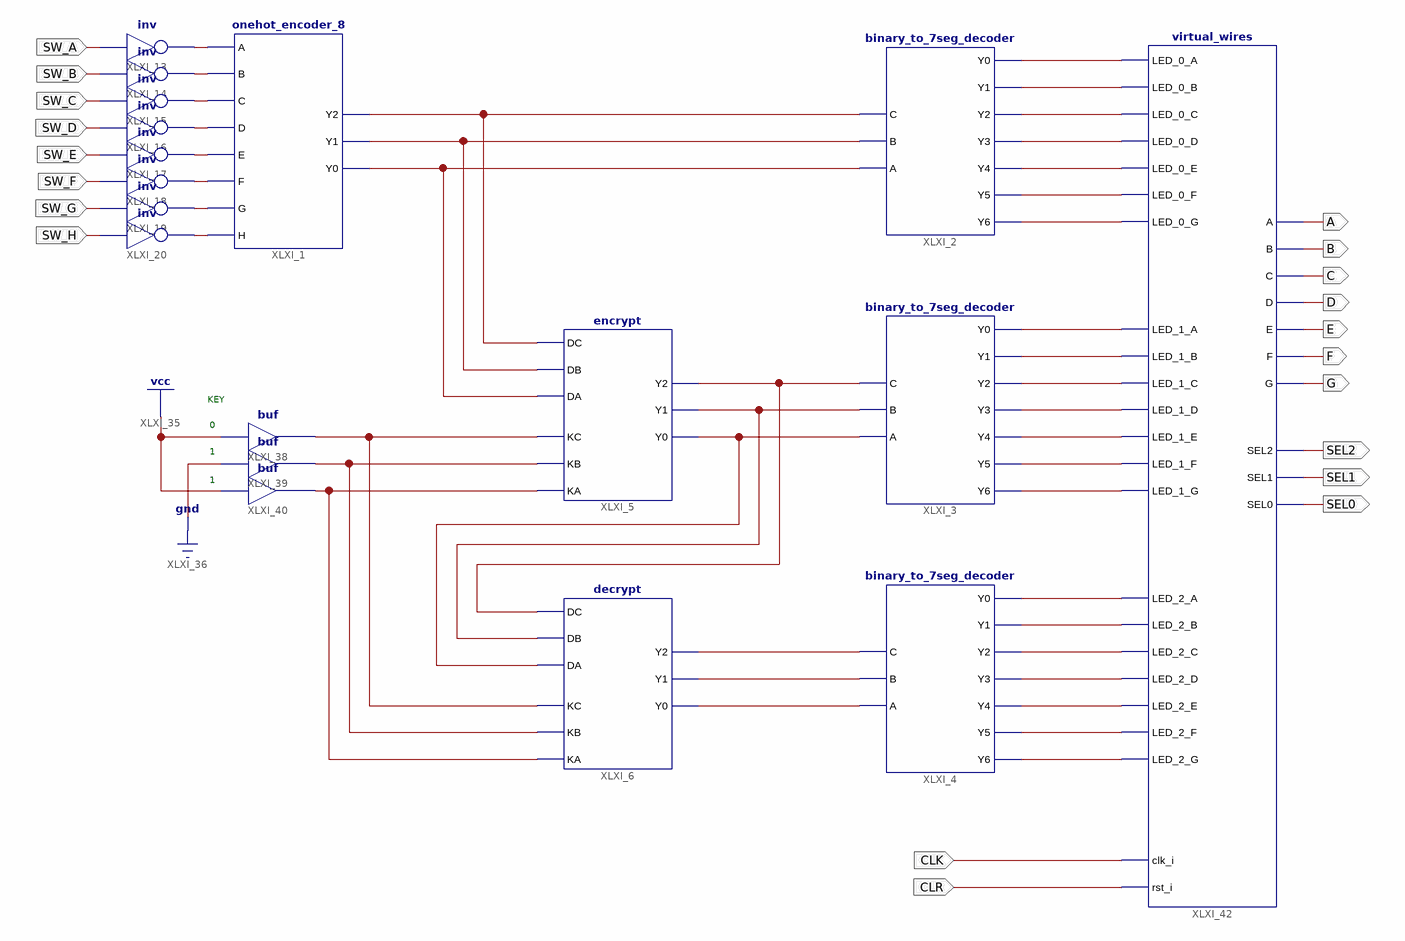
[diagram p0: schematic sheet 1]
// Xilinx ISE schematic top_level.sch (zynq) as structural Verilog: 18 symbols, 20 ports
module top_level (
  input  SW_A,
  input  SW_B,
  input  SW_C,
  input  SW_D,
  input  SW_E,
  input  SW_F,
  input  SW_G,
  input  SW_H,
  input  CLR,
  input  CLK,
  output SEL1,
  output SEL2,
  output SEL0,
  output A,
  output B,
  output C,
  output D,
  output E,
  output F,
  output G
);

  wire XLXN_4, XLXN_5, XLXN_7, XLXN_15, XLXN_17, XLXN_19, XLXN_26, XLXN_27, XLXN_28, XLXN_56, XLXN_57,
       XLXN_58, XLXN_59, XLXN_60, XLXN_61, XLXN_62, XLXN_63, XLXN_104, XLXN_105, XLXN_106, XLXN_107,
       XLXN_108, XLXN_109, XLXN_110, XLXN_111, XLXN_112, XLXN_113, XLXN_114, XLXN_115, XLXN_116, XLXN_117,
       XLXN_118, XLXN_119, XLXN_120, XLXN_121, XLXN_122, XLXN_123, XLXN_124, XLXN_139, XLXN_140, XLXN_141;

  decrypt XLXI_6 (
    .Y1(XLXN_27), .DC(XLXN_17), .DB(XLXN_15), .DA(XLXN_19), .KC(XLXN_139), .KB(XLXN_140), .KA(XLXN_141),
    .Y0(XLXN_28), .Y2(XLXN_26));
  encrypt XLXI_5 (
    .DC(XLXN_4), .DB(XLXN_5), .DA(XLXN_7), .KC(XLXN_139), .KB(XLXN_140), .KA(XLXN_141), .Y1(XLXN_15),
    .Y0(XLXN_19), .Y2(XLXN_17));
  onehot_encoder_8 XLXI_1 (
    .E(XLXN_60), .F(XLXN_61), .G(XLXN_62), .H(XLXN_63), .Y1(XLXN_5), .Y0(XLXN_7), .Y2(XLXN_4), .D(XLXN_59),
    .A(XLXN_56), .B(XLXN_57), .C(XLXN_58));
  not XLXI_13 (XLXN_56, SW_A);
  not XLXI_14 (XLXN_57, SW_B);
  not XLXI_15 (XLXN_58, SW_C);
  not XLXI_16 (XLXN_59, SW_D);
  not XLXI_17 (XLXN_60, SW_E);
  not XLXI_18 (XLXN_61, SW_F);
  not XLXI_19 (XLXN_62, SW_G);
  not XLXI_20 (XLXN_63, SW_H);
  binary_to_7seg_decoder XLXI_3 (
    .B(XLXN_15), .Y0(XLXN_111), .Y1(XLXN_112), .Y2(XLXN_113), .Y3(XLXN_114), .Y4(XLXN_115), .Y5(XLXN_116),
    .Y6(XLXN_117), .A(XLXN_19), .C(XLXN_17));
  binary_to_7seg_decoder XLXI_4 (
    .B(XLXN_27), .Y0(XLXN_118), .Y1(XLXN_119), .Y2(XLXN_120), .Y3(XLXN_121), .Y4(XLXN_122), .Y5(XLXN_123),
    .Y6(XLXN_124), .A(XLXN_28), .C(XLXN_26));
  binary_to_7seg_decoder XLXI_2 (
    .B(XLXN_5), .Y0(XLXN_104), .Y1(XLXN_105), .Y2(XLXN_106), .Y3(XLXN_107), .Y4(XLXN_108), .Y5(XLXN_109),
    .Y6(XLXN_110), .A(XLXN_7), .C(XLXN_4));
  buf XLXI_38 (XLXN_139, 1'b1);
  buf XLXI_39 (XLXN_140, 1'b0);
  buf XLXI_40 (XLXN_141, 1'b1);
  virtual_wires XLXI_42 (
    .A(A), .B(B), .C(C), .D(D), .E(E), .F(F), .G(G), .LED_0_A(XLXN_104), .LED_0_B(XLXN_105),
    .LED_0_C(XLXN_106), .LED_0_D(XLXN_107), .LED_0_E(XLXN_108), .LED_0_F(XLXN_109), .LED_0_G(XLXN_110),
    .SEL2(SEL2), .SEL1(SEL1), .SEL0(SEL0), .LED_1_A(XLXN_111), .LED_1_B(XLXN_112), .LED_1_C(XLXN_113),
    .LED_1_D(XLXN_114), .LED_1_E(XLXN_115), .LED_1_F(XLXN_116), .LED_1_G(XLXN_117), .LED_2_A(XLXN_118),
    .LED_2_B(XLXN_119), .LED_2_C(XLXN_120), .LED_2_D(XLXN_121), .LED_2_E(XLXN_122), .LED_2_F(XLXN_123),
    .LED_2_G(XLXN_124), .clk_i(CLK), .rst_i(CLR));

  // Notes on the sheet:
  //   KEY
  //   0
  //   1
  //   1
endmodule
